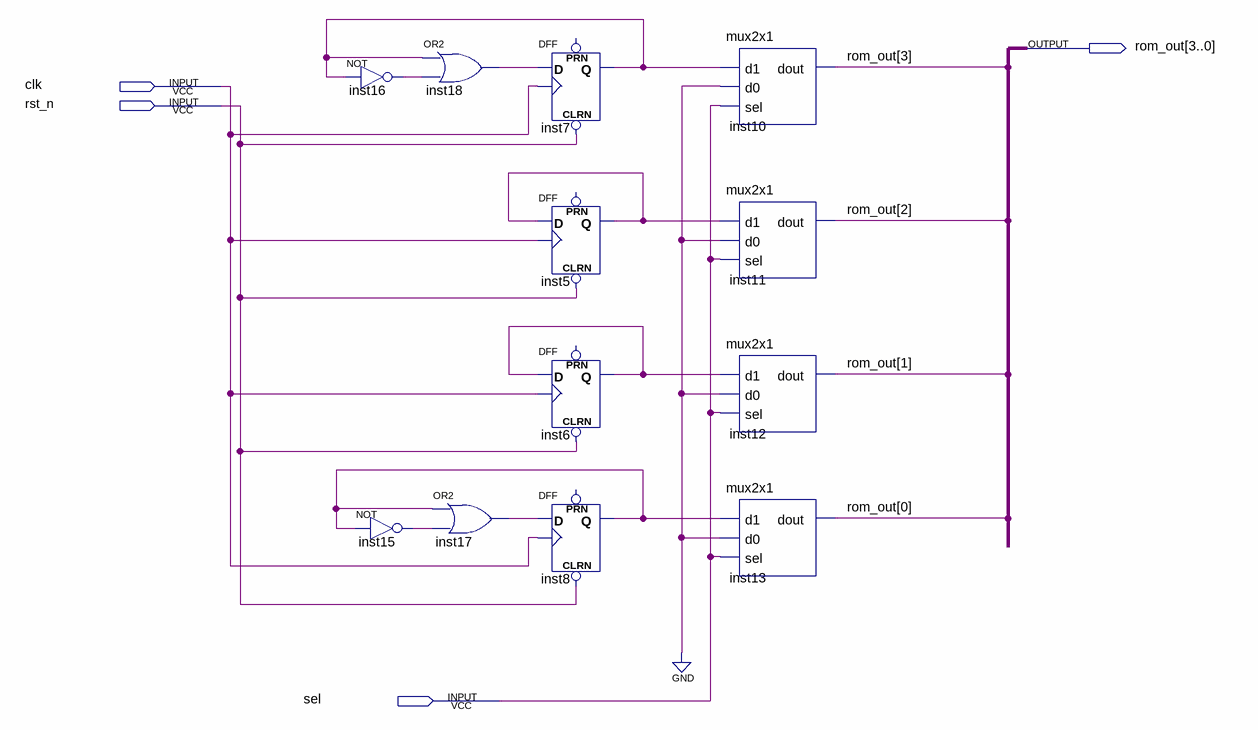
[diagram p0: schematic sheet]
// Quartus schematic rom_1001.bdf as structural Verilog: 12 symbols, 4 pins
module rom_1001 (
  input  clk,
  input  rst_n,
  input  sel,
  output [3:0] rom_out
);

  wire inst5_q, inst6_q, inst7_q, inst8_q, inst15_out, inst16_out, inst17_out, inst18_out;

  not inst16 (inst16_out, inst7_q);
  not inst15 (inst15_out, inst8_q);
  or inst18 (inst18_out, inst7_q, inst16_out);
  or inst17 (inst17_out, inst8_q, inst15_out);
  DFF inst7 (.CLRN(rst_n), .CLK(clk), .D(inst18_out), .Q(inst7_q));  // open: PRN
  DFF inst5 (.CLRN(rst_n), .CLK(clk), .D(inst5_q), .Q(inst5_q));  // open: PRN
  DFF inst6 (.CLRN(rst_n), .CLK(clk), .D(inst6_q), .Q(inst6_q));  // open: PRN
  DFF inst8 (.CLRN(rst_n), .CLK(clk), .D(inst17_out), .Q(inst8_q));  // open: PRN
  mux2x1 inst10 (.d1(inst7_q), .d0(1'b0), .sel(sel), .dout(rom_out[3]));
  mux2x1 inst11 (.d1(inst5_q), .d0(1'b0), .sel(sel), .dout(rom_out[2]));
  mux2x1 inst12 (.d1(inst6_q), .d0(1'b0), .sel(sel), .dout(rom_out[1]));
  mux2x1 inst13 (.d1(inst8_q), .d0(1'b0), .sel(sel), .dout(rom_out[0]));
endmodule
